# Altium schematic sheet Upstream_Port.SchDoc: Upstream Port
size 431 x 279 mm; Author: Eric Liu; SheetNumber: 4; SheetTotal: 6
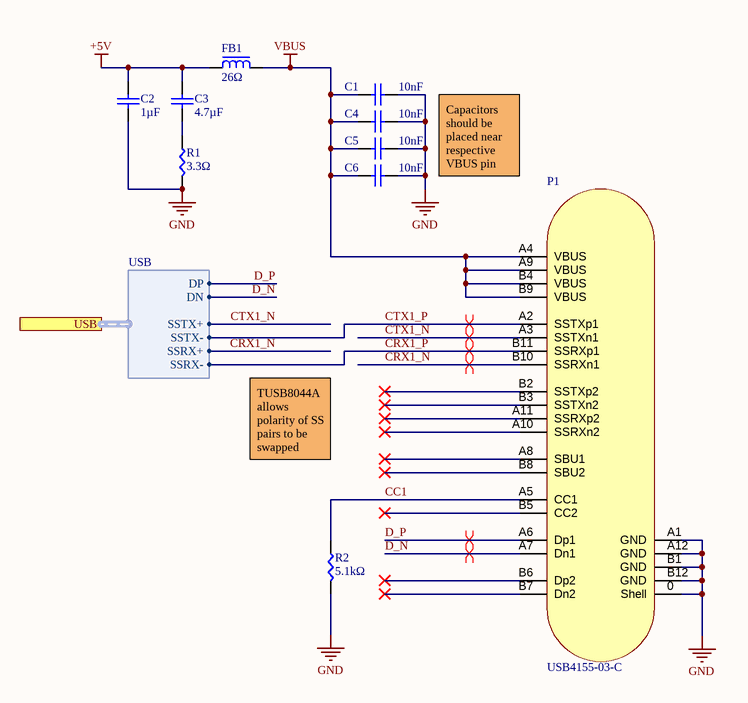
[diagram p0: Upstream_Port.SchDoc]

## Parts
C1  value 10nF  [CAP0402]  (hidden comment: CC0402KRX7R9BB103)
C2  value 1µF  [CAP0402]  (hidden comment: GRM155R61H105KE05D)
C3  value 4.7µF  [CAP0603]  (hidden comment: GRM188R61E475KE11D)
C4  value 10nF  [CAP0402]  (hidden comment: CC0402KRX7R9BB103)
C5  value 10nF  [CAP0402]  (hidden comment: CC0402KRX7R9BB103)
C6  value 10nF  [CAP0402]  (hidden comment: CC0402KRX7R9BB103)
FB1  value 26Ω  [BLM18SG260TN1D]  (hidden comment: BLM18SG260TN1D)
P1  USB4155-03-C  [USB4155-03-C]
R1  value 3.3Ω  [RES0402]  (hidden comment: ESR10EZPJ3R3)
R2  value 5.1kΩ  [RES0402]  (hidden comment: RC0402FR-075K1L)

## Ports
USB (harness USB)

## Harnesses
USB: DP, DN, SSRX+, SSRX-, SSTX+, SSTX-

## Nets
+5V: C2.2 C3.2 FB1.1
GND: C1.1 C2.1 C4.1 C5.1 C6.1 P1.0(Shell) P1.A1(GND) P1.A12(GND) P1.B1(GND) P1.B12(GND) R1.1 R2.1
VBUS: C1.2 C4.2 C5.2 C6.2 FB1.2 P1.A4(VBUS) P1.A9(VBUS) P1.B4(VBUS) P1.B9(VBUS)
CC1: P1.A5(CC1) R2.2
CRX1_N: P1.B10(SSRXn1) ; port USB.SSRX+
CRX1_P: P1.B11(SSRXp1) ; port USB.SSRX-
CTX1_N: P1.A3(SSTXn1) ; port USB.SSTX+
CTX1_P: P1.A2(SSTXp1) ; port USB.SSTX-
D_N: P1.A7(Dn1) ; port USB.DN
D_P: P1.A6(Dp1) ; port USB.DP
NetC3_1: C3.1 R1.2

Not connected (* = marked no-connect by the designer): P1 A8(SBU1)* A10(SSRXn2)* A11(SSRXp2)* B2(SSTXp2)* B3(SSTXn2)* B5(CC2)* B6(Dp2)* B7(Dn2)* B8(SBU2)*

## Layout directives
differential pair: CRX1_N, CRX1_P, CTX1_N, CTX1_P, D_N, D_P

## Notes on the sheet
- Capacitors should be placed near respective VBUS pin
- TUSB8044A allows polarity of SS pairs to be swapped
- DWG. NO.
- REV.
- SHT.
- THIS DOCUMENT AND THE DATA DISCLOSED HEREIN OR HEREWITH IS THE PROPERTY OF ALTIUM LIMITED AND MAY BE FREELY DISTRIBUTED IN WHOLE. NO RIGHTS ARE RESERVED OR EXPRESS OR IMPLIED WARANTEE GIVEN.
- REVISION
- DESCRIPTION
- DATE
- APPROVED
- ENG:
- APPROVALS
- PROJECT
- DSN:
- CHK:
- REFERENCE DOCUMENTS
- PROJECT REVISION:
- TITLE
- DOCUMENT REVISION:
- DESIGN ITEM:
- BOM:
- FAB DWG:
- PCB DWG:
- ASSY DWG:
- SCALE:
- SIZE
- B
- CAGE CODE
- FILE NAME
- DWG NO.
- SHEET
- OF
- REV

## Library data of the parts
C1 C4-C6 = CC0402KRX7R9BB103: 10000 pF ±10% 50V Ceramic Capacitor X7R 0402 (1005 Metric); Temperature Coefficient: X7R; Package: 0402 (1005 Metric); Voltage: 50V
C2 = GRM155R61H105KE05D: 1 µF ±10% 50V Ceramic Capacitor X5R 0402 (1005 Metric); Temperature Coefficient: X5R; Package: 0402 (1005 Metric); Voltage: 50V
C3 = GRM188R61E475KE11D: 4.7 µF ±10% 25V Ceramic Capacitor X5R 0603 (1608 Metric); Temperature Coefficient: X5R; Package: 0603 (1608 Metric); Voltage: 25V
FB1 = BLM18SG260TN1D: 26 Ohms @ 100 MHz 1 Power Line Ferrite Bead 0603 (1608 Metric) 6A 7mOhm; Manufacturer 1: Murata Electronics; Manufacturer Part Number 1: BLM18SG260TN1D; Supplier Part Number 1: 490-3995-1-ND; Supplier 1: Digi-Key; Current Rating: 6A
P1 = USB4155-03-C: USB-C (USB TYPE-C) USB 3.2 Gen 2 (USB 3.1 Gen 2, Superspeed + (USB 3.1)) Plug Connector 24 Position Board Edge, Surface Mount; Through Hole, Right Angle; Manufacturer: GCT; Manufacturer Product Number: USB4056-03-A; Voltage: 48VDC; Supplier: DigiKey; Supplier Part Number: 2073-USB4056-03-ACT-ND; Datasheet: https://gct.co/connector/usb4056; Standards: USB 3.2 Gen 2; Operating Temperature: -25°C ~ 85°C
R1 = ESR10EZPJ3R3: 3.3 Ohms ±5% 0.5W, 1/2W Chip Resistor 0805 (2012 Metric) Automotive AEC-Q200, Pulse Withstanding Thick Film; Manufacturer 1: Rohm Semiconductor; Manufacturer Part Number 1: ESR10EZPJ3R3; Supplier Part Number 1: RHM3.3KCT-ND; Supplier 1: Digi-Key; Power Rating: 1/2W
R2 = RC0402FR-075K1L: 5.1 kOhms ±1% 0.063W, 1/16W Chip Resistor 0402 (1005 Metric) Moisture Resistant Thick Film; Manufacturer 1: YAGEO; Manufacturer Part Number 1: RC0402FR-075K1L; Supplier Part Number 1: 311-5.10KLRCT-ND; Supplier 1: Digi-Key; Power Rating: 1/16W